# EAGLE design smt-led-testing-mk-1.0 (EAGLE 7.5.0)
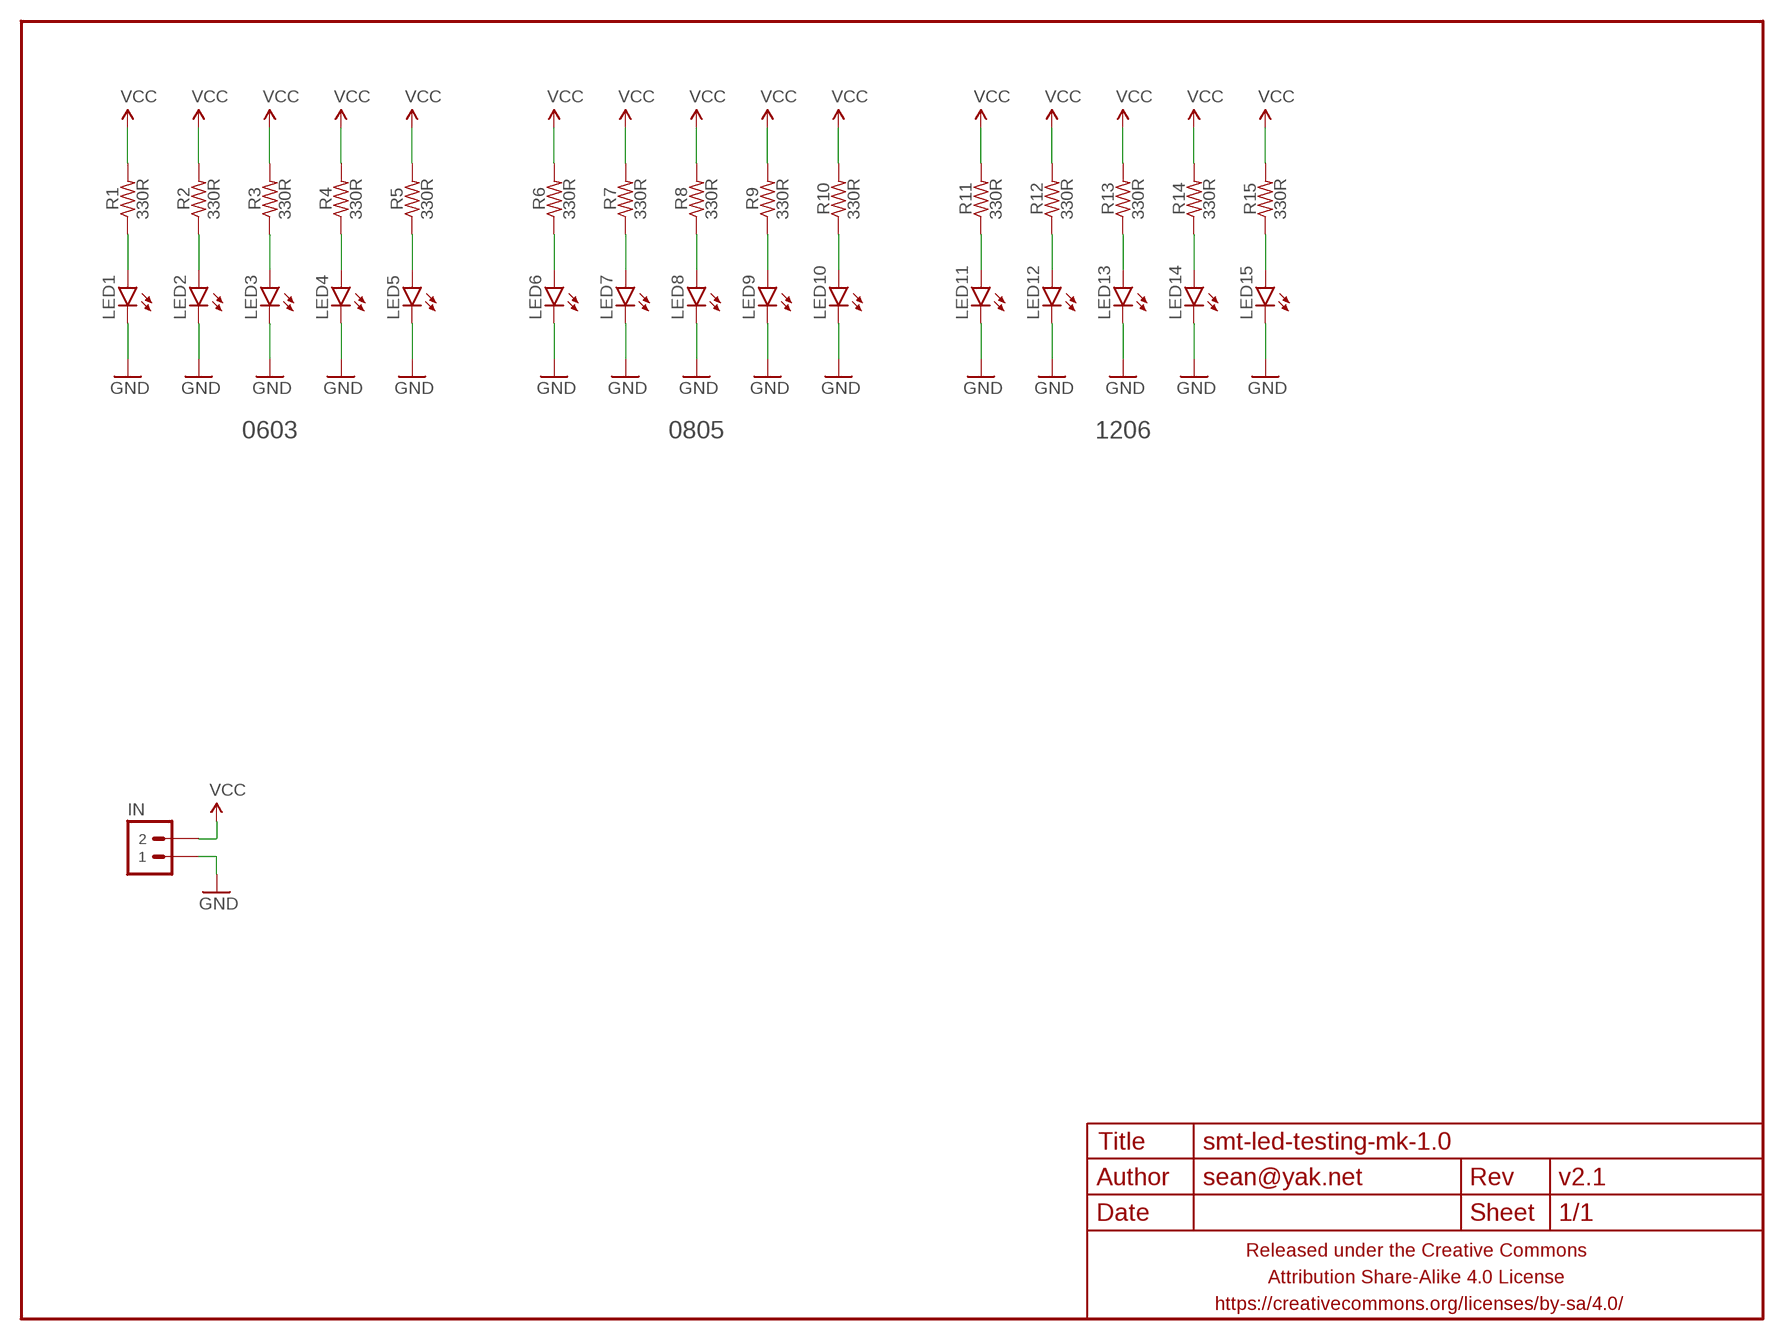
[diagram p0: schematic, sheet 1]

## Parts
FRAME1  FRAME-LETTERNO_PACKAGE  [DUMMY]
IN  M02PTH-CENTERED-R+  [1X02-CENTER-R+]
LED1  LED0603  [LED-0603]
LED2  LED0603  [LED-0603]
LED3  LED0603  [LED-0603]
LED4  LED0603  [LED-0603]
LED5  LED0603  [LED-0603]
LED6  LED0805  [LED-0805]
LED7  LED0805  [LED-0805]
LED8  LED0805  [LED-0805]
LED9  LED0805  [LED-0805]
LED10  LED0805  [LED-0805]
LED11  LED1206  [LED-1206]
LED12  LED1206  [LED-1206]
LED13  LED1206  [LED-1206]
LED14  LED1206  [LED-1206]
LED15  LED1206  [LED-1206]
R1  330R  RESISTORR0603  [R0603]
R2  330R  RESISTORR0603  [R0603]
R3  330R  RESISTORR0603  [R0603]
R4  330R  RESISTORR0603  [R0603]
R5  330R  RESISTORR0603  [R0603]
R6  330R  RESISTORR0603  [R0603]
R7  330R  RESISTORR0603  [R0603]
R8  330R  RESISTORR0603  [R0603]
R9  330R  RESISTORR0603  [R0603]
R10  330R  RESISTORR0603  [R0603]
R11  330R  RESISTORR0603  [R0603]
R12  330R  RESISTORR0603  [R0603]
R13  330R  RESISTORR0603  [R0603]
R14  330R  RESISTORR0603  [R0603]
R15  330R  RESISTORR0603  [R0603]

## Nets
GND: IN.1 LED1.C LED2.C LED3.C LED4.C LED5.C LED6.C LED7.C LED8.C LED9.C LED10.C LED11.C LED12.C LED13.C LED14.C LED15.C
N$1: LED1.A R1.1
N$2: LED2.A R2.1
N$3: LED3.A R3.1
N$4: LED4.A R4.1
N$5: LED5.A R5.1
N$6: LED6.A R6.1
N$7: LED7.A R7.1
N$8: LED8.A R8.1
N$9: LED9.A R9.1
N$10: LED10.A R10.1
N$11: LED11.A R11.1
N$12: LED12.A R12.1
N$13: LED13.A R13.1
N$14: LED14.A R14.1
N$15: LED15.A R15.1
VCC: IN.2 R1.2 R2.2 R3.2 R4.2 R5.2 R6.2 R7.2 R8.2 R9.2 R10.2 R11.2 R12.2 R13.2 R14.2 R15.2

## Notes on the sheet
- 0603 | 0805 | 1206

## Library data of the parts
FRAME1 = a_parts:FRAME-LETTER: Schematic Frame Standard 8.5x11 US Letter frame; DESIGNER: sean@yak.net; VERSION: v2.1
IN = a_parts:M02: Standard 2-pin 0.1" header. Use with - straight break away headers ( PRT-00116) - right angle break away headers (PRT-00553) - swiss pins (PRT-00743) - machine pins (PRT-00117) - female headers (PRT-00115) Molex polarized connector foot print use with: PRT-08233 with associated crimp pins and housings. 2.54_SCREWTERM for use with PRT-10571. 3.5mm Screw Terminal footprints for PRT-08084 5mm Screw Terminal footprints for use with PRT-08433
LED1-LED15 = a_parts:LED: LEDs Standard schematic elements and footprints for 5mm, 3mm, 1206, and 0603 sized LEDs. 5mm - Spark Fun Electronics SKU : COM-00529 (and others)
R1-R15 = a_parts:RESISTOR: RESISTOR, American symbol

## Board
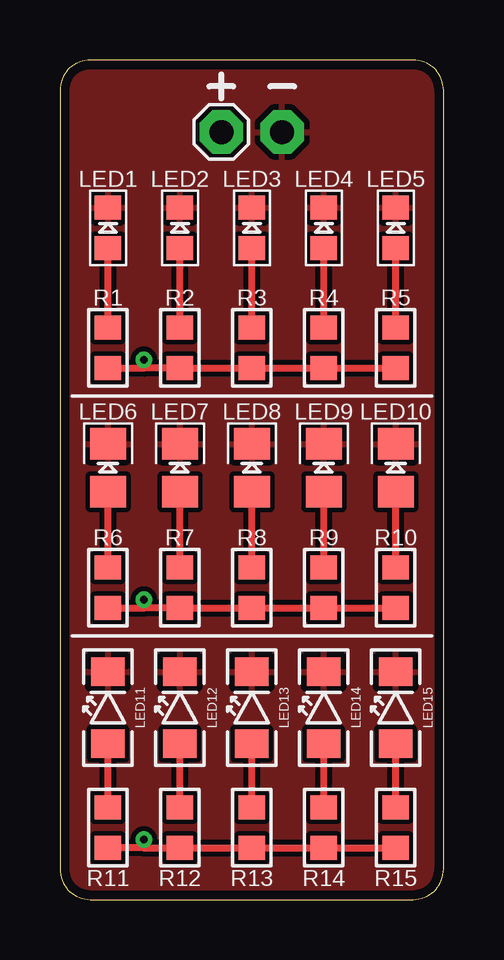
[diagram p1: board, top side]
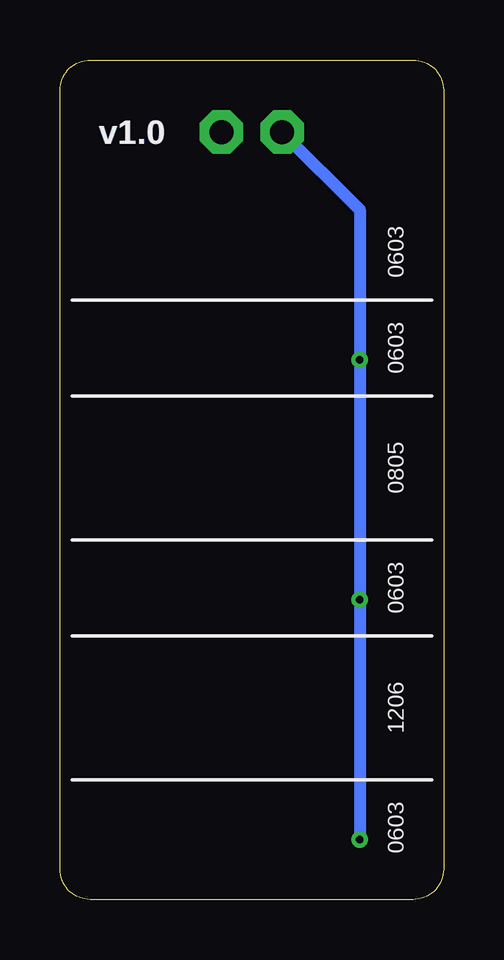
[diagram p2: board, bottom side, seen from below]

Size 16 x 35 mm. Coordinates in mm from the lower left corner, seen from the top.
Outline: 1.27,0 14.73,0 arc90 16,1.27 16,33.73 arc90 14.73,35 1.27,35 arc90 0,33.73 0,1.27 arc90 1.27,0
Copper layers (1*16): Top 0.0356mm / dielectric 1.5011mm / Bottom 0.0356mm
Design rules "LaenPCBOrder_2": minimum track width 6mil, minimum drill 13mil, track to track 6mil, track to pad 6mil, pad to pad 6mil, via to via 6mil, smd to smd 6mil, copper to edge 15mil, drill to drill 6mil, minimum pad ring 7mil, minimum via ring 7mil, stop-mask expansion 3mil, vias tented up to drill 20mil, thermal gap 10mil

### Footprints (pad centres in the part's own frame; a part is rotated, then mirrored left to right if it is on the bottom)
1X02-CENTER-R+ = drill 1 pad 1.8 octagon: 1 -1.27,0; 2 1.27,0
LED-0603 = smd 1.1 x 1: A 0,-0.85; C 0,0.85
LED-0805 = smd 1.5 x 1.3: A 0,-1; C 0,1
LED-1206 = smd 1.2 x 1.4: A -1.5,0; C 1.5,0
R0603 = smd 1 x 1.1: 1 -0.85,0; 2 0.85,0

### Placement (x,y rotation side)
FRAME1  0,0 0 top
IN  8,32 180 top
LED1  2,28 0 top
LED2  5,28 0 top
LED3  8,28 0 top
LED4  11,28 0 top
LED5  14,28 0 top
LED6  2,18 0 top
LED7  5,18 0 top
LED8  8,18 0 top
LED9  11,18 0 top
LED10  14,18 0 top
LED11  2,8 90 top
LED12  5,8 90 top
LED13  8,8 90 top
LED14  11,8 90 top
LED15  14,8 90 top
R1  2,23 270 top
R2  5,23 270 top
R3  8,23 270 top
R4  11,23 270 top
R5  14,23 270 top
R6  2,13 270 top
R7  5,13 270 top
R8  8,13 270 top
R9  11,13 270 top
R10  14,13 270 top
R11  2,3 270 top
R12  5,3 270 top
R13  8,3 270 top
R14  11,3 270 top
R15  14,3 270 top

### Tracks (layer width: path | path; a pad name or v marks a point on that pad's centre or on a via)
GND
  pour Top (isolate 0.2): 0,1.27 0,33.73 arc-90 1.27,35 14.73,35 arc-90 16,33.73 16,1.27 arc-90 14.73,0 1.27,0 arc-90
N$1
  Top 0.3: R1.1 LED1.A
N$2
  Top 0.3: R2.1 LED2.A
N$3
  Top 0.3: R3.1 LED3.A
N$4
  Top 0.3: R4.1 LED4.A
N$5
  Top 0.3: R5.1 LED5.A
N$6
  Top 0.3: R6.1 LED6.A
N$7
  Top 0.3: R7.1 LED7.A
N$8
  Top 0.3: R8.1 LED8.A
N$9
  Top 0.3: R9.1 LED9.A
N$10
  Top 0.3: R10.1 LED10.A
N$11
  Top 0.3: R11.1 LED11.A
N$12
  Top 0.3: R12.1 LED12.A
N$13
  Top 0.3: R13.1 LED13.A
N$14
  Top 0.3: R14.1 LED14.A
N$15
  Top 0.3: R15.1 LED15.A
VCC  (via drill 0.33)
  Top 0.3: v3.5,2.5 3.5,2.15 | 3.5,2.15 R11.2 | 3.5,2.15 R12.2 R13.2 R14.2 R15.2 | R1.2 3.5,22.15 | 3.5,22.15 R2.2 R3.2 R4.2 R5.2 | 3.5,22.15 v3.5,22.5 | R6.2 3.5,12.15 | 3.5,12.15 R7.2 R8.2 R9.2 R10.2 | 3.5,12.15 v3.5,12.5
  Bottom 0.5: IN.2 3.5,28.77 v3.5,22.5 v3.5,12.5 v3.5,2.5

### Text on the board
bPlace: 0603 | 0603 | 0805 | 0603 | 1206 | 0603